# Altium project MixedSignalPCB.PrjPcb
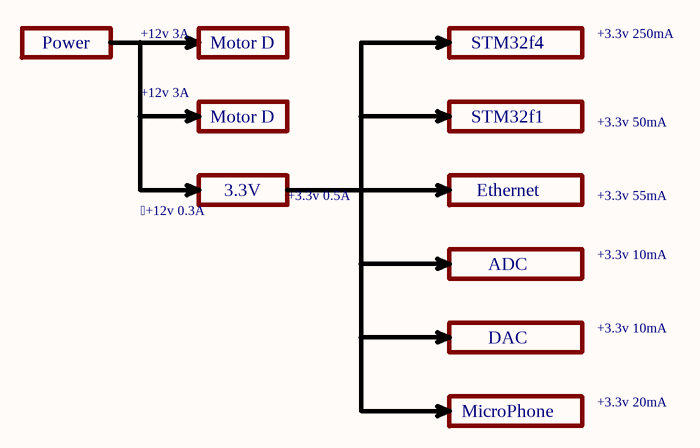
[diagram p0: Power.SchDoc]
11 sheets, 191 parts. Net scope: flat (ports and power ports of the same name join across sheets).
Board file: PCB1.PcbDoc
Sheets:
  Power.SchDoc
  Ethernet.SchDoc
  STM32F103_DEBUG.SchDoc
  STM32F407.SchDoc
  MotorDriver.SchDoc
  UART.SchDoc
  ADC.SchDoc
  DAC.SchDoc
  Mic.SchDoc
  MotorDriver2.SchDoc
  PowerSupply.SchDoc

## Sheet Power.SchDoc
size A4; SheetNumber: 1; SheetTotal: 8

### Notes on the sheet
- Power
- +12v 3A
- Motor D
- STM32f4
- +3.3v 250mA
- STM32f1
- +3.3v 50mA
- 3.3V
- +3.3v 0.5A
- Ethernet
- +3.3v 55mA
- +12v 0.3A
- ADC
- +3.3v 10mA
- DAC
- MicroPhone
- +3.3v 20mA

## Sheet Ethernet.SchDoc
size A; SheetNumber: 2; SheetTotal: 11
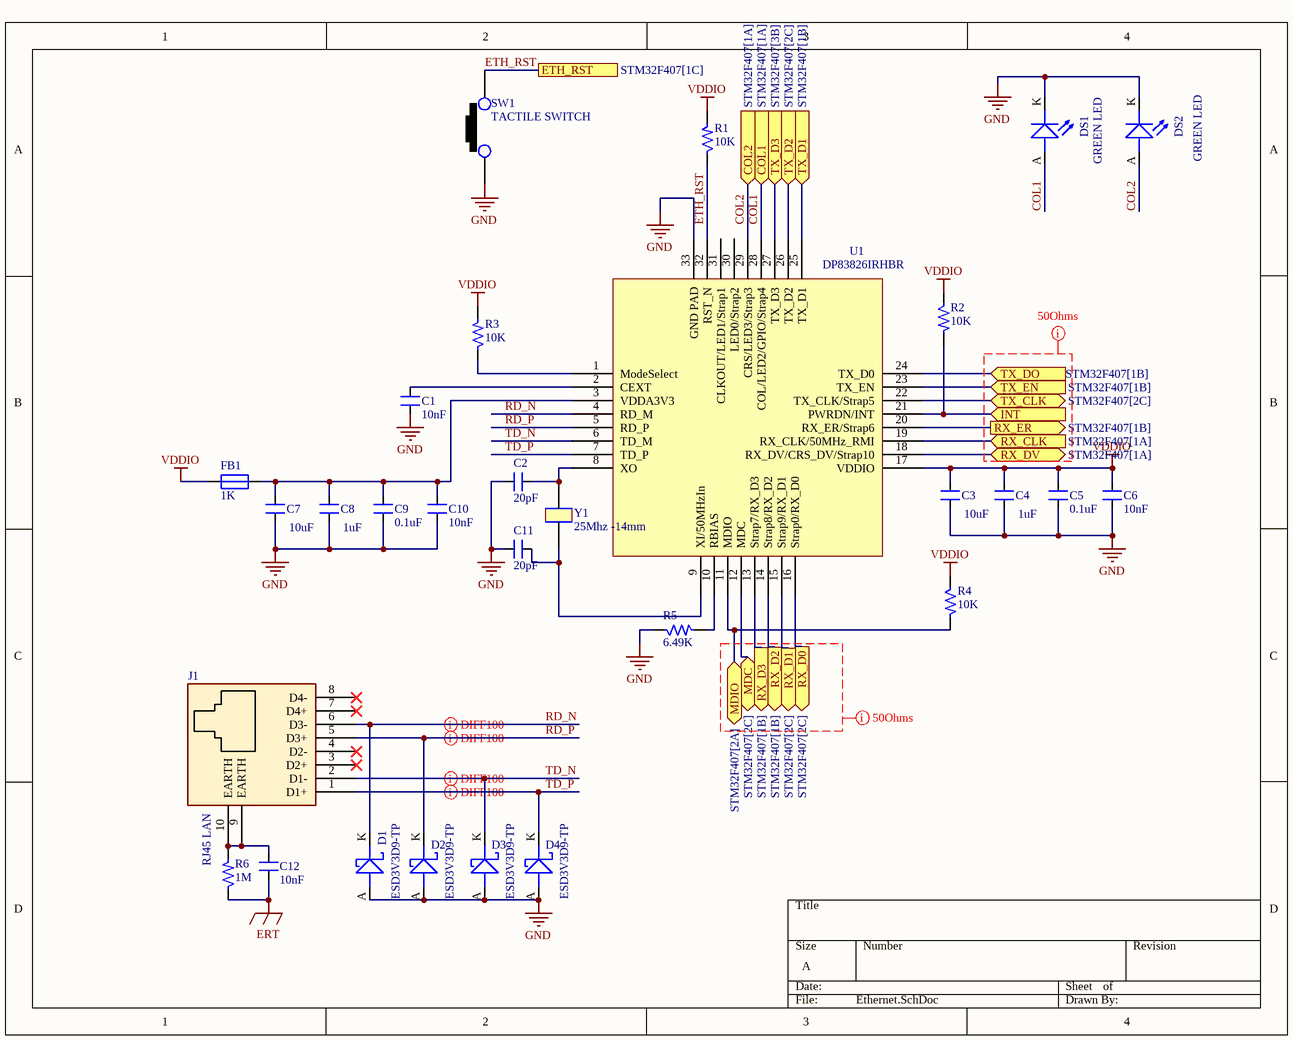
[diagram p1: Ethernet.SchDoc]

### Parts
C1  10nF  [CAP_0805]
C2  20pF  [CAP_0805]
C3  10uF  [CAP_1206]
C4  1uF  [CAP_0805]
C5  0.1uF  [CAP_0805]
C6  10nF  [CAP_0805]
C7  10uF  [CAP_1206]
C8  1uF  [CAP_0805]
C9  0.1uF  [CAP_0805]
C10  10nF  [CAP_0805]
C11  20pF  [CAP_0805]
C12  10nF  [CAP_P196_102X287_H332_RAD_TH]
D1  ESD3V3D9-TP  [DIO_SOD-923]
D2  ESD3V3D9-TP  [DIO_SOD-923]
D3  ESD3V3D9-TP  [DIO_SOD-923]
D4  ESD3V3D9-TP  [DIO_SOD-923]
DS1  GREEN LED  [LED_0805]
DS2  GREEN LED  [LED_0805]
FB1  1K  [IND_0805]
J1  RJ45 LAN  [CON10_P106_RJ45_TH_ST]
R1  10K  [RES_0805]
R2  10K  [RES_0603]
R3  10K  [RES_0805]
R4  10K  [RES_0603]
R5  6.49K  [RES_0805]
R6  1M  [RES_1206]
SW1  TACTILE SWITCH  [SW_342_SMD]
U1  DP83826IRHBR  [VQFN32_19_218_23X9_SMD]
Y1  25Mhz -14mm  [XTAL_314_240X47_SMD]

### Ports
COL1 (in, see STM32F407[1A]), COL2 (in, see STM32F407[1A]), ETH_RST (see STM32F407[1C]), INT (in), MDC (bidir, see STM32F407[2C]), MDIO (bidir, see STM32F407[2A]), RX_CLK (in, see STM32F407[1A]), RX_D0 (out, see STM32F407[2C]), RX_D1 (out, see STM32F407[2C]), RX_D2 (out, see STM32F407[1B]), RX_D3 (out, see STM32F407[1B]), RX_DV (bidir, see STM32F407[1A]), RX_ER (out, see STM32F407[1B]), TX_CLK (bidir, see STM32F407[2C]), TX_D1 (in, see STM32F407[1B]), TX_D2 (in, see STM32F407[2C]), TX_D3 (in, see STM32F407[3B]), TX_DO (in, see STM32F407[1B]), TX_EN (in, see STM32F407[1B])

### Nets
ERT: C12.1 R6.1
GND: C1.1 C2.1 C3.1 C4.1 C5.1 C6.1 C7.1 C8.1 C9.1 C10.1 C11.1 D1.A D2.A D3.A D4.A DS1.K(CATHODE) DS2.K(CATHODE) R5.1 SW1.1 U1.33(GND_PAD)
VDDIO: C3.2 C4.2 C5.2 C6.2 FB1.1 R1.2 R2.1 R3.2 R4.1 U1.17(VDDIO)
COL1: DS1.A(ANODE) U1.28(COL/LED2/GPIO/Strap4) ; port COL1
COL2: DS2.A(ANODE) U1.29(CRS/LED3/Strap3) ; port COL2
ETH_RST: R1.1 SW1.2 U1.32(RST_N) ; port ETH_RST
INT: R2.2 U1.21(PWRDN/INT) ; port INT
MDC: U1.12(MDC) ; port MDC
MDIO: R4.2 U1.11(MDIO) ; port MDIO
RD_N: D1.K J1.6(D3-) U1.4(RD_M)
RD_P: D2.K J1.5(D3+) U1.5(RD_P)
RX_CLK: U1.19(RX_CLK/50MHz_RMI) ; port RX_CLK
RX_D0: U1.16(Strap0/RX_D0) ; port RX_D0
RX_D1: U1.15(Strap9/RX_D1) ; port RX_D1
RX_D2: U1.14(Strap8/RX_D2) ; port RX_D2
RX_D3: U1.13(Strap7/RX_D3) ; port RX_D3
RX_DV: U1.18(RX_DV/CRS_DV/Strap10) ; port RX_DV
RX_ER: U1.20(RX_ER/Strap6) ; port RX_ER
TD_N: D3.K J1.2(D1-) U1.6(TD_M)
TD_P: D4.K J1.1(D1+) U1.7(TD_P)
TX_CLK: U1.22(TX_CLK/Strap5) ; port TX_CLK
TX_D1: U1.25(TX_D1) ; port TX_D1
TX_D2: U1.26(TX_D2) ; port TX_D2
TX_D3: U1.27(TX_D3) ; port TX_D3
TX_DO: U1.24(TX_D0) ; port TX_DO
TX_EN: U1.23(TX_EN) ; port TX_EN
NetC1_2: C1.2 U1.2(CEXT)
NetC2_2: C2.2 U1.8(XO) Y1.1
NetC7_2: C7.2 C8.2 C9.2 C10.2 FB1.2 U1.3(VDDA3V3)
NetC11_2: C11.2 U1.9(XI/50MHzIn) Y1.2
NetC12_2: C12.2 J1.9(EARTH) J1.10(EARTH) R6.2
NetR3_1: R3.1 U1.1(ModeSelect)
NetR5_2: R5.2 U1.10(RBIAS)

Not connected (* = marked no-connect by the designer): J1 3(D2+)* 4(D2-)* 7(D4+)* 8(D4-)*; U1 30(LED0/Strap2) 31(CLKOUT/LED1/Strap1)

### Layout directives
differential pair; differential pair class *DIFF100: RD_N, RD_P, TD_N, TD_P
net class *50Ohms: (no net found under the mark)

### Library data of the parts
C1 C6 C10 = CAP_10nF-50V-10%-0805: 10000pF ±10% 50V Ceramic Capacitor X7R 0805 (2012 Metric); Manufacturer: Samsung; Manufacturer Part Number: C0805C103K5RECAUTO; Alternate Part Number-1: GRM2195C1H103JA01D; Case/Package: 0805; Supplier-1: SIRICOM; Supplier Part Number-1: 0805B103K500CT
C2 C11 = CAP_20pF-50V-10%-0805: ±10% 50V Ceramic Capacitor C0G, NP0 0805 (2012 Metric); Manufacturer: AVX Corporation; Manufacturer Part Number: 08055A200KAT2A; Alternate Part Number-1: NA; Case/Package: 0805; Supplier-1: Digikey; Supplier Part Number-1: 478-11887-1-ND - Cut Tape (CT)
C3 C7 = CAP_10uF-50V-10%-1206: 10µF ±10% 50V Ceramic Capacitor X7R 1206 (3216 Metric); Manufacturer: KEMET; Manufacturer Part Number: CL31B106KBHNNNE; Alternate Part Number-1: GRT31CR61H106ME01L; Case/Package: 1206; Supplier-1: SIRICOM; Supplier Part Number-1: CC1206KKX5R9BB106
C4 C8 = CAP_1uF-50V-5%-0805: 1µF ±5% 50V Ceramic Capacitor X7R 0805 (2012 Metric); Manufacturer: Samsung; Manufacturer Part Number: CC0805JKX7R9BB105; Alternate Part Number-1: 0805F105M500NT; Case/Package: 0805; Supplier-1: SIRICOM; Supplier Part Number-1: CL21B105KBFNNNE
C5 C9 = CAP_0.1uF-50V-5%-0805: 0.1µF ±5% 50V Ceramic Capacitor X7R 0805 (2012 Metric); Manufacturer: AVX Corporation; Manufacturer Part Number: 08055C104JAT4A; Alternate Part Number-1: 0805B104M500; Case/Package: 0805; Supplier-1: SIRICOM; Supplier Part Number-1: 0805B104J500CT
C12 = CAP_10nF-1KV-10%-RAD-TH: 10000pF ±10% 1000V (1kV) Ceramic Capacitor X7R Radial; Manufacturer: Yageo; Manufacturer Part Number: RDER73A103K2K1H03B; Alternate Part Number-1: NA; Case/Package: TH; Supplier-1: SP ROAD; Supplier Part Number-1: RDER73A103K2K1H03B
D1-D4 = DIO-T_3.3V-8.8V-10A-SOD923: TVS DIODE 3.3V 8.8V SOD923; Manufacturer: Micro Commercial Co; Alternate Part Number-1: NA; Manufacturer Part Number: ESD3V3D9-TP; Case/Package: SOD923; Supplier-1: Digikey; Supplier Part Number-1: ESD3V3D9-TPMSTR-ND
DS1 DS2 = LED_GREEN-2.2-20mA-0805: Green 569nm LED Indication - Discrete 2.1V 0805 (2012 Metric); Manufacturer: Vishay Lite-On; Manufacturer Part Number: LTST-C171GKT; Alternate Part Number-1: NA; Case/Package: 0805; Supplier-1: SP ROAD; Supplier Part Number-1: LTST-C171GKT
FB1 = FB_1K-100MHZ-1.6A-0805: 1 kOhms @ 100MHz 1 Power Line Ferrite Bead 0805 (2012 Metric) 1.6A; Manufacturer: Laird; Manufacturer Part Number: BLM21SP102SH1D; Alternate Part Number-1: NA; Case/Package: 0805; Supplier-1: SIRICOM; Supplier Part Number-1: ACMS201209A102
J1 = CON-SKT-RJ_8C8P-RA-TH: 8 Pins, 2 Row 2.54mm Pitch, right angle Connector, male; Manufacturer: Assmann; Manufacturer Part Number: A-2004-2-4-LPS-N-R; Alternate Part Number-1: NA; Case/Package: TH-CON; Supplier-1: SP ROAD; Supplier Part Number-1: A-2004-2-4-LPS-N-R
R1 R3 = RES_10K-0.125W-1%-0805: 10 kOhms ±1% 0.125W, 1/8W Chip Resistor 0805 (2012 Metric) Automotive AEC-Q200 Thick Film; Manufacturer: CTS; Manufacturer Part Number: WR08X1002FTL; Case/Package: 0805; Supplier-1: SIRICOM; Supplier Part Number-1: WR08X1002FTL; Alternate Part Number-1: WR08X1002FTL
R2 R4 = RES_10K-0.1W-1%-0603: 10 kOhms ±1% 0.1W, 1/10W Chip Resistor 0603 (1608 Metric) Automotive AEC-Q200 Thick Film; Manufacturer: Walsin; Manufacturer Part Number: WR06X1002FTL; Alternate Part Number-1: 0603WAJ0103T5E; Case/Package: 0603; Supplier-1: SIRICOM; Supplier Part Number-1: WR06X1002FTL
R5 = RES_6.49K-0.125W-1%-0805: 6.49 kOhms ±1% 0.125W, 1/8W Chip Resistor 0805 (2012 Metric) Moisture Resistant Thick Film; Manufacturer: Stackpole Electronics; Manufacturer Part Number: RC0805FR-076K49L; Alternate Part Number-1: NA; Case/Package: 0805; Supplier-1: SIRICOM; Supplier Part Number-1: WRO8X6491FTL
R6 = RES_1M-0.25W-1%-1206: 1 MOhms ±1% 0.25W, 1/4W Chip Resistor 1206 (3216 Metric) Automotive AEC-Q200, High Voltage Thick Film; Manufacturer: Walsin; Manufacturer Part Number: WR12X1004FTL; Alternate Part Number-1: NA; Case/Package: 1206; Supplier-1: SIRICOM; Supplier Part Number-1: WR12X1004FTL
SW1 = SW1_RS-282G05A3-SMRT-SMD: Tactile Switch SPST-NO Top Actuated Surface Mount; Manufacturer: ITT C&K; Alternate Part Number-1: NA; Manufacturer Part Number: RS-282G05A3-SMRT; Case/Package: SMD; Supplier-1: SP ROAD; Supplier Part Number-1: RS-282G05A3-SMRT
U1 = IC_DP83826IRHBR: Ethernet ICs Low latency 10/100-Mbps PHY, MII interface and enhanced mode with an industrial temperature range 32-VQFN -40 to 85; Manufacturer: Texas Instruments; Alternate Part Number-1: NA; Manufacturer Part Number: DP83826IRHBR; Case/Package: 32-VQFN; Supplier-1: Mouser; Supplier Part Number-1: 595-DP83826IRHBR
Y1 = XTAL_25Mhz-FOXSDLF/250F-20: 25MHz ±30ppm Crystal 20pF 30 Ohms HC-49/US; Manufacturer: Abracon; Alternate Part Number-1: NA; Manufacturer Part Number: FOXSDLF/250F-20; Case/Package: SMD; Supplier-1: MOUSER; Supplier Part Number-1: FOXSDLF/250F-20

## Sheet STM32F103_DEBUG.SchDoc
size A; SheetNumber: 3; SheetTotal: 11
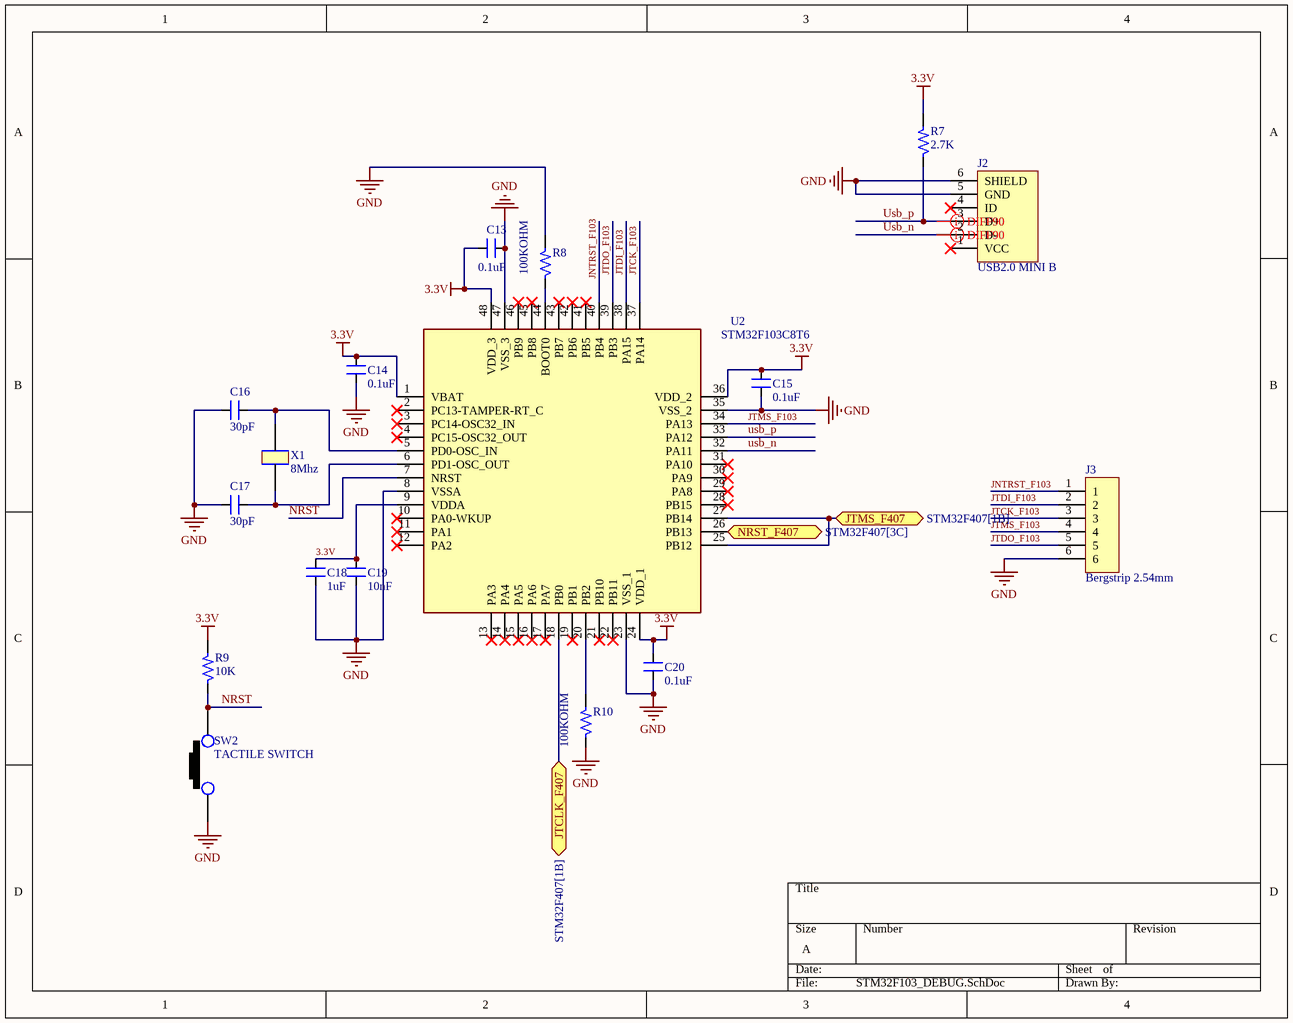
[diagram p2: STM32F103_DEBUG.SchDoc]

### Parts
C13  0.1uF  [CAP_0805]
C14  0.1uF  [CAP_0805]
C15  0.1uF  [CAP_0805]
C16  30pF  [CAP_0805]
C17  30pF  [CAP_0805]
C18  1uF  [CAP_0805]
C19  10nF  [CAP_0805]
C20  0.1uF  [CAP_0805]
J2  USB2.0 MINI B  [CON_690-005-299-043]
J3  Bergstrip 2.54mm  [CON6_100_59D78_TH_ST]
R7  2.7K  [RES_0805]
R8  100KOHM  [RES_2512]
R9  10K  [RES_0603]
R10  100KOHM  [RES_2512]
SW2  TACTILE SWITCH  [SW_342_SMD]
U2  STM32F103C8T6  [LQFP-48_19.6_393_58X11_SMD]
X1  8Mhz  [XTAL_314_240X47_SMD]

### Ports
JTCLK_F407 (bidir, see STM32F407[1B]), JTMS_F407 (bidir, see STM32F407[1B]), NRST_F407 (bidir, see STM32F407[3C])

### Nets
3.3V: C13.2 C14.2 C15.2 C18.2 C19.2 C20.2 R7.2 R9.2 U2.1(VBAT) U2.9(VDDA) U2.24(VDD_1) U2.36(VDD_2) U2.48(VDD_3)
GND: C13.1 C14.1 C15.1 C16.1 C17.1 C18.1 C19.1 C20.1 J2.5(GND) J2.6(SHIELD) J3.6 R8.2 R10.1 SW2.1 U2.8(VSSA) U2.23(VSS_1) U2.35(VSS_2) U2.47(VSS_3)
JNTRST_F103: J3.1 U2.40(PB4)
JTCK_F103: J3.3 U2.37(PA14)
JTCLK_F407: U2.18(PB0) ; port JTCLK_F407
JTDI_F103: J3.2 U2.38(PA15)
JTDO_F103: J3.5 U2.39(PB3)
JTMS_F103: J3.4 U2.34(PA13)
JTMS_F407: U2.25(PB12) U2.27(PB14) ; port JTMS_F407
NRST: R9.1 SW2.2 U2.7(NRST)
NRST_F407: U2.26(PB13) ; port NRST_F407
Usb_n: J2.2(D-) U2.32(PA11)
Usb_p: J2.3(D+) R7.1 U2.33(PA12)
NetC16_2: C16.2 U2.5(PD0-OSC_IN) X1.2
NetC17_2: C17.2 U2.6(PD1-OSC_OUT) X1.1
NetR8_1: R8.1 U2.44(BOOT0)
NetR10_2: R10.2 U2.20(PB2)

Not connected (* = marked no-connect by the designer): J2 1(VCC)* 4(ID)*; U2 2(PC13-TAMPER-RT_C)* 3(PC14-OSC32_IN)* 4(PC15-OSC32_OUT)* 10(PA0-WKUP)* 11(PA1)* 12(PA2)* 13(PA3)* 14(PA4)* 15(PA5)* 16(PA6)* 17(PA7)* 19(PB1)* 21(PB10)* 22(PB11)* 28(PB15)* 29(PA8)* 30(PA9)* 31(PA10)* 41(PB5)* 42(PB6)* 43(PB7)* 45(PB8)* 46(PB9)*

### Layout directives
differential pair; differential pair class *DIFF90: Usb_n, Usb_p

### Library data of the parts
C13-C15 = CAP_0.1uF-50V-20%-0805: 0.1µF ±20% 50V Ceramic Capacitor X7R 0805 (2012 Metric); Manufacturer: Samsung Electro-Mechanics; Manufacturer Part Number: CL21B104MBCNNNC; Alternate Part Number-1: NA; Case/Package: 0805; Supplier-1: SIRICOM; Supplier Part Number-1: 0805B104K500CT
C16 C17 = CAP_30pF-50V-10%-0805: ±10% 50V Ceramic Capacitor C0G, NP0 0805 (2012 Metric); Manufacturer Part Number: C0805C300K5GAC7800; Manufacturer: KEMET; Alternate Part Number: NA; Case/Package: 0805; Supplier-1: Digikey; Supplier Part Number-1: 399-17443-1-ND - Cut Tape (CT)
C18 = CAP_1uF-50V-5%-0805: as C4 on sheet Ethernet; Case/Package: 0805; Supplier-1: SIRICOM; Supplier Part Number-1: CL21B105KBFNNNE
C19 = CAP_10nF-50V-10%-0805: as C1 on sheet Ethernet; Case/Package: 0805; Supplier-1: SIRICOM; Supplier Part Number-1: 0805B103K500CT
C20 = CAP_0.1uF-50V-5%-0805: as C5 on sheet Ethernet; Case/Package: 0805; Supplier-1: SIRICOM; Supplier Part Number-1: 0805B104J500CT
J2 = CON_USB2.0-MINIB-SMD: USB - mini B USB 2.0 Receptacle Connector 5 Position Surface Mount, Right Angle; Manufacturer: EDAC; Manufacturer Part Number: 690-005-299-043; Alternate Part Number-1: NA; Case/Package: USB-MINI-B; Supplier-1: LCSC; Supplier Part Number-1: C105424
J3 = CON-BS-SKT_6X1-100-ST-TH: 6 Pins, 1 Row 2.54mm Pitch, Straight bergstrip, Female; Manufacturer: Molex; Alternate Part Number-1: NA; Manufacturer Part Number: 22-10-2061; Case/Package: TH-CON; Supplier-1: SP ROAD; Supplier Part Number-1: NA
R7 = RES_2.7K-0.125W-1%-0805: 2.7 kOhms ±1% 0.125W, 1/8W Chip Resistor 0805 (2012 Metric) Thick Film; Manufacturer: Stackpole Electronics; Manufacturer Part Number: 1623181-1; Alternate Part Number-1: NA; Case/Package: 0805; Supplier-1: SIRICOM; Supplier Part Number-1: WR08X2701FTL
R8 R10 = RES_100mOHM-1W-5%-2512: 100 mOhms ±5% 1W Chip Resistor 2512 (6432 Metric) High Voltage, Non-Magnetic Thick Film; Manufacturer: CTS Resistor Products; Manufacturer Part Number: 73L7R10J; Alternate Part Number-1: CR2512J0R12E04; Case/Package: 2512; Supplier-1: SP ROAD; Supplier Part Number-1: NA
R9 = RES_10K-0.1W-1%-0603: as R2 on sheet Ethernet; Case/Package: 0603; Supplier-1: SIRICOM; Supplier Part Number-1: WR06X1002FTL
SW2 = SW1_RS-282G05A3-SMRT-SMD: as SW1 on sheet Ethernet; Manufacturer Part Number: RS-282G05A3-SMRT; Case/Package: SMD; Supplier-1: SP ROAD; Supplier Part Number-1: RS-282G05A3-SMRT
U2 = IC_STM32F103C8T6: ARM® Cortex®-M3 STM32F1 Microcontroller IC 32-Bit 72MHz 64KB (64K x 8) FLASH 48-LQFP (7x7); Manufacturer: STMicroelectronics; Alternate Part Number-1: NA; Manufacturer Part Number: STM32F103C8T6; Case/Package: LQFP48; Supplier-1: LCSC; Supplier Part Number-1: STM32F103C8T6
X1 = XTAL_8MHZ-ECS-80-32-5PX-SMD: 8MHz ±30ppm Crystal 32pF 60 Ohms HC-49/US; Manufacturer: Fox Electronics; Manufacturer Part Number: ECS-80-32-5PX-TR; Alternate Part Number-1: NA; Case/Package: SMD/SMT; Supplier-1: SP ROAD; Supplier Part Number-1: ECS-80-32-5PX-TR

## Sheet STM32F407.SchDoc
size A; SheetNumber: 4; SheetTotal: 11
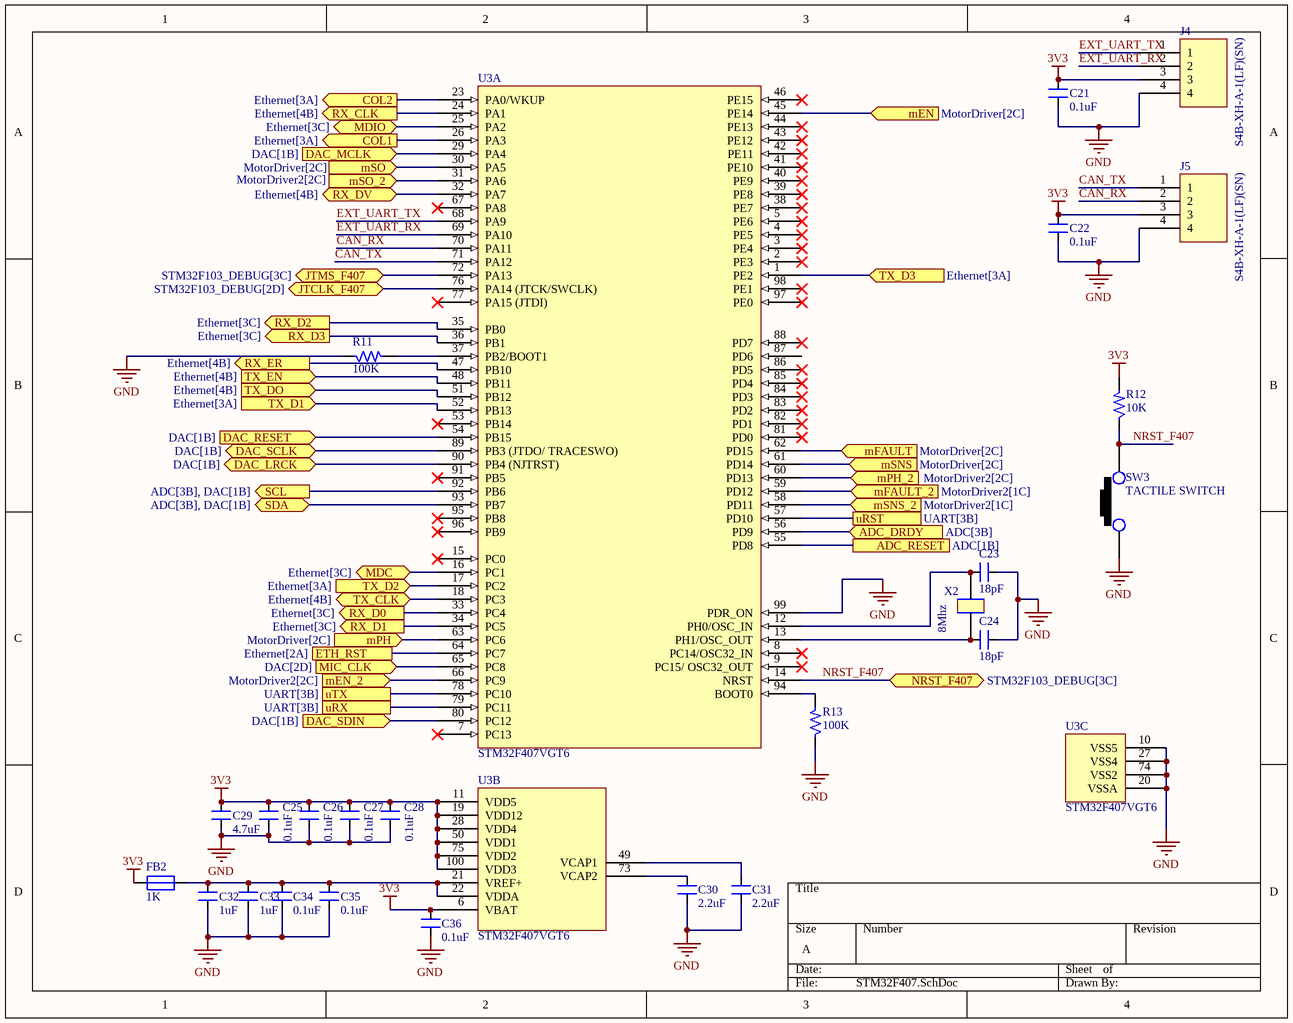
[diagram p3: STM32F407.SchDoc]

### Parts
C21  0.1uF  [CAP_0805]
C22  0.1uF  [CAP_0805]
C23  18pF  [CAP_0805]
C24  18pF  [CAP_0805]
C25  0.1uF  [CAP_0805]
C26  0.1uF  [CAP_0805]
C27  0.1uF  [CAP_0805]
C28  0.1uF  [CAP_0805]
C29  4.7uF  [CAP_0805]
C30  2.2uF  [CAP_0805]
C31  2.2uF  [CAP_0805]
C32  1uF  [CAP_0805]
C33  1uF  [CAP_0805]
C34  0.1uF  [CAP_0805]
C35  0.1uF  [CAP_0805]
C36  0.1uF  [CAP_0805]
FB2  1K  [IND_0805]
J4  S4B-XH-A-1(LF)(SN)  [CON4_100_S4B-XH-A_TH_RA]
J5  S4B-XH-A-1(LF)(SN)  [CON4_100_S4B-XH-A_TH_RA]
R11  100K  [RES_0805]
R12  10K  [RES_0603]
R13  100K  [RES_0805]
SW3  TACTILE SWITCH  [SW_342_SMD]
U3  STM32F407VGT6  [QFN100_19.6_669_58X10_SMD]  (parts A,B,C of 3)
X2  8Mhz  [XTAL_314_240X47_SMD]

### Ports
ADC_DRDY (in, see ADC[3B]), ADC_RESET (see ADC[1B]), COL1 (out, see Ethernet[3A]), COL2 (out, see Ethernet[3A]), DAC_LRCK (bidir, see DAC[1B]), DAC_MCLK (in, see DAC[1B]), DAC_RESET (in, see DAC[1B]), DAC_SCLK (bidir, see DAC[1B]), DAC_SDIN (in, see DAC[1B]), ETH_RST (see Ethernet[2A]), JTCLK_F407 (bidir, see STM32F103_DEBUG[2D]), JTMS_F407 (bidir, see STM32F103_DEBUG[3C]), MDC (bidir, see Ethernet[3C]), MDIO (bidir, see Ethernet[3C]), mEN (in, see MotorDriver[2C]), mEN_2 (in, see MotorDriver2[2C]), mFAULT (in, see MotorDriver[2C]), mFAULT_2 (in, see MotorDriver2[1C]), MIC_CLK (in, see DAC[2D]), mPH (in, see MotorDriver[2C]), mPH_2 (in, see MotorDriver2[2C]), mSNS (in, see MotorDriver[2C]), mSNS_2 (in, see MotorDriver2[1C]), mSO (in, see MotorDriver[2C]), mSO_2 (in, see MotorDriver2[2C]), NRST_F407 (bidir, see STM32F103_DEBUG[3C]), RX_CLK (out, see Ethernet[4B]), RX_D0 (out, see Ethernet[3C]), RX_D1 (out, see Ethernet[3C]), RX_D2 (out, see Ethernet[3C]), RX_D3 (out, see Ethernet[3C]), RX_DV (bidir, see Ethernet[4B]), RX_ER (out, see Ethernet[4B]), SCL (out, see ADC[3B], DAC[1B]), SDA (bidir, see ADC[3B], DAC[1B]), TX_CLK (bidir, see Ethernet[4B]), TX_D1 (in, see Ethernet[3A]), TX_D2 (in, see Ethernet[3A]), TX_D3 (in, see Ethernet[3A]), TX_DO (in, see Ethernet[4B]), TX_EN (in, see Ethernet[4B]), uRST (see UART[3B]), uRX (see UART[3B]), uTX (see UART[3B])

### Nets
3V3: C21.2 C22.2 C25.2 C26.2 C27.2 C28.2 C29.1 C36.2 FB2.1 J4.3 J5.3 R12.2 U3.6(VBAT) U3.11(VDD5) U3.19(VDD12) U3.28(VDD4) U3.50(VDD1) U3.75(VDD2) U3.100(VDD3)
GND: C21.1 C22.1 C23.2 C24.2 C25.1 C26.1 C27.1 C28.1 C29.2 C30.2 C31.1 C32.1 C33.1 C34.1 C35.1 C36.1 J4.4 J5.4 R11.1 R13.1 SW3.1 U3.10(VSS5) U3.20(VSSA) U3.27(VSS4) U3.74(VSS2) U3.99(PDR_ON)
ADC_DRDY: U3.56(PD9) ; port ADC_DRDY
ADC_RESET: U3.55(PD8) ; port ADC_RESET
CAN_RX: J5.2 U3.70(PA11)
CAN_TX: J5.1 U3.71(PA12)
COL1: U3.26(PA3) ; port COL1
COL2: U3.23(PA0/WKUP) ; port COL2
DAC_LRCK: U3.90(PB4_(NJTRST)) ; port DAC_LRCK
DAC_MCLK: U3.29(PA4) ; port DAC_MCLK
DAC_RESET: U3.54(PB15) ; port DAC_RESET
DAC_SCLK: U3.89(PB3_(JTDO/_TRACESWO)) ; port DAC_SCLK
DAC_SDIN: U3.80(PC12) ; port DAC_SDIN
ETH_RST: U3.64(PC7) ; port ETH_RST
EXT_UART_RX: J4.2 U3.69(PA10)
EXT_UART_TX: J4.1 U3.68(PA9)
JTCLK_F407: U3.76(PA14_(JTCK/SWCLK)) ; port JTCLK_F407
JTMS_F407: U3.72(PA13) ; port JTMS_F407
MDC: U3.16(PC1) ; port MDC
MDIO: U3.25(PA2) ; port MDIO
mEN: U3.45(PE14) ; port mEN
mEN_2: U3.66(PC9) ; port mEN_2
mFAULT: U3.62(PD15) ; port mFAULT
mFAULT_2: U3.59(PD12) ; port mFAULT_2
MIC_CLK: U3.65(PC8) ; port MIC_CLK
mPH: U3.63(PC6) ; port mPH
mPH_2: U3.60(PD13) ; port mPH_2
mSNS: U3.61(PD14) ; port mSNS
mSNS_2: U3.58(PD11) ; port mSNS_2
mSO: U3.30(PA5) ; port mSO
mSO_2: U3.31(PA6) ; port mSO_2
NRST_F407: R12.1 SW3.2 U3.14(NRST) ; port NRST_F407
RX_CLK: U3.24(PA1) ; port RX_CLK
RX_D0: U3.33(PC4) ; port RX_D0
RX_D1: U3.34(PC5) ; port RX_D1
RX_D2: U3.35(PB0) ; port RX_D2
RX_D3: U3.36(PB1) ; port RX_D3
RX_DV: U3.32(PA7) ; port RX_DV
RX_ER: U3.47(PB10) ; port RX_ER
SCL: U3.92(PB6) ; port SCL
SDA: U3.93(PB7) ; port SDA
TX_CLK: U3.18(PC3) ; port TX_CLK
TX_D1: U3.52(PB13) ; port TX_D1
TX_D2: U3.17(PC2) ; port TX_D2
TX_D3: U3.1(PE2) ; port TX_D3
TX_DO: U3.51(PB12) ; port TX_DO
TX_EN: U3.48(PB11) ; port TX_EN
uRST: U3.57(PD10) ; port uRST
uRX: U3.79(PC11) ; port uRX
uTX: U3.78(PC10) ; port uTX
NetC23_1: C23.1 U3.12(PH0/OSC_IN) X2.2
NetC24_1: C24.1 U3.13(PH1/OSC_OUT) X2.1
NetC30_1: C30.1 U3.73(VCAP2)
NetC31_2: C31.2 U3.49(VCAP1)
NetC32_2: C32.2 C33.2 C34.2 C35.2 FB2.2 U3.21(VREF+) U3.22(VDDA)
NetR11_2: R11.2 U3.37(PB2/BOOT1)
NetR13_2: R13.2 U3.94(BOOT0)

Not connected (* = marked no-connect by the designer): U3 2(PE3)* 3(PE4)* 4(PE5)* 5(PE6)* 7(PC13)* 8(PC14/OSC32_IN)* 9(PC15/_OSC32_OUT)* 15(PC0)* 38(PE7)* 39(PE8)* 40(PE9)* 41(PE10)* 42(PE11)* 43(PE12)* 44(PE13)* 46(PE15)* 53(PB14)* 67(PA8)* 77(PA15_(JTDI))* 81(PD0)* 82(PD1)* 83(PD2)* 84(PD3)* 85(PD4)* 86(PD5)* 87(PD6) 88(PD7)* 91(PB5)* 95(PB8)* 96(PB9)* 97(PE0)* 98(PE1)*

### Library data of the parts
C21 C22 C25-C28 C34-C36 = CAP_0.1uF-50V-5%-0805: as C5 on sheet Ethernet; Case/Package: 0805; Supplier-1: SIRICOM; Supplier Part Number-1: 0805B104J500CT
C23 C24 = CAP_18pF-50V-5%-0805: 18pF ±5% 50V Ceramic Capacitor C0G, NP0 0805 (2012 Metric); Manufacturer: Yageo; Manufacturer Part Number: CL21C180JBANNNC; Alternate Part Number-1: NA; Case/Package: 0805; Supplier-1: NA; Supplier Part Number-1: NA
C29 = CAP_4.7uF-50V-10%-0805: 4.7µF ±10% 50V Ceramic Capacitor X5R 0805 (2012 Metric); Manufacturer: Yageo; Manufacturer Part Number: GRM21BR61H475KE51L; Alternate Part Number-1: NA; Case/Package: 0805; Supplier-1: SIRICOM; Supplier Part Number-1: CL21A475KBQNNNE
C30 C31 = CAP_2.2uF-25V-10%-0805: 2.2µF ±10% 25V Ceramic Capacitor X7R 0805 (2012 Metric); Manufacturer: KEMET; Manufacturer Part Number: CL21B225KAFNFNE; Alternate Part Number-1: NA; Case/Package: 0805; Supplier-1: SIRICOM; Supplier Part Number-1: CL21A225KAFNNNE
C32 C33 = CAP_1uF-50V-5%-0805: as C4 on sheet Ethernet; Case/Package: 0805; Supplier-1: SIRICOM; Supplier Part Number-1: CL21B105KBFNNNE
FB2 = FB_1K-100MHZ-1.6A-0805: as FB1 on sheet Ethernet; Case/Package: 0805; Supplier-1: SIRICOM; Supplier Part Number-1: ACMS201209A102
J4 J5 = CON-PLG_4X1-100-RA-TH: 4 Pins, 1 Row 2.54mm Pitch, right angle Connector, male; Manufacturer: Wurth Electronics; Mating Part Number: XHP-4; Crimp Part Number: ASXHSXH22K51; Alternate Part Number-1: NA; Manufacturer Part Number: S4B-XH-A-1(LF)(SN); Case/Package: TH-CON; Supplier-1: LCSC; Supplier Part Number-1: S4B-XH-A
R11 R13 = RES_100K-0.125W-1%-0805: 100 kOhms ±1% 0.125W, 1/8W Chip Resistor 0805 (2012 Metric) Automotive AEC-Q200 Thick Film; Manufacturer: Walsin; Manufacturer Part Number: WR08X1003FTL; Alternate Part Number-1: NA; Case/Package: 0805; Supplier-1: SIRICOM; Supplier Part Number-1: WR08X1003FTL
R12 = RES_10K-0.1W-1%-0603: as R2 on sheet Ethernet; Case/Package: 0603; Supplier-1: SIRICOM; Supplier Part Number-1: WR06X1002FTL
SW3 = SW1_RS-282G05A3-SMRT-SMD: as SW1 on sheet Ethernet; Manufacturer Part Number: RS-282G05A3-SMRT; Case/Package: SMD; Supplier-1: SP ROAD; Supplier Part Number-1: RS-282G05A3-SMRT
U3 = IC_STM32F407VGT6: ARM® Cortex®-M4 STM32F4 Microcontroller IC 32-Bit 168MHz 1MB (1M x 8) FLASH 100-LQFP (14x14); Manufacturer: STMicroelectronics; Alternate Part Number-1: STM32F407VET6; Manufacturer Part Number: STM32F407VGT6; Case/Package: LQFP100; Supplier-1: ARROW; Supplier Part Number-1: STM32F407VGT6
X2 = XTAL_8MHZ-ECS-80-32-5PX-SMD: as X1 on sheet STM32F103_DEBUG; Case/Package: SMD/SMT; Supplier-1: SP ROAD; Supplier Part Number-1: ECS-80-32-5PX-TR

## Sheet MotorDriver.SchDoc
size A4; SheetNumber: 5; SheetTotal: 11
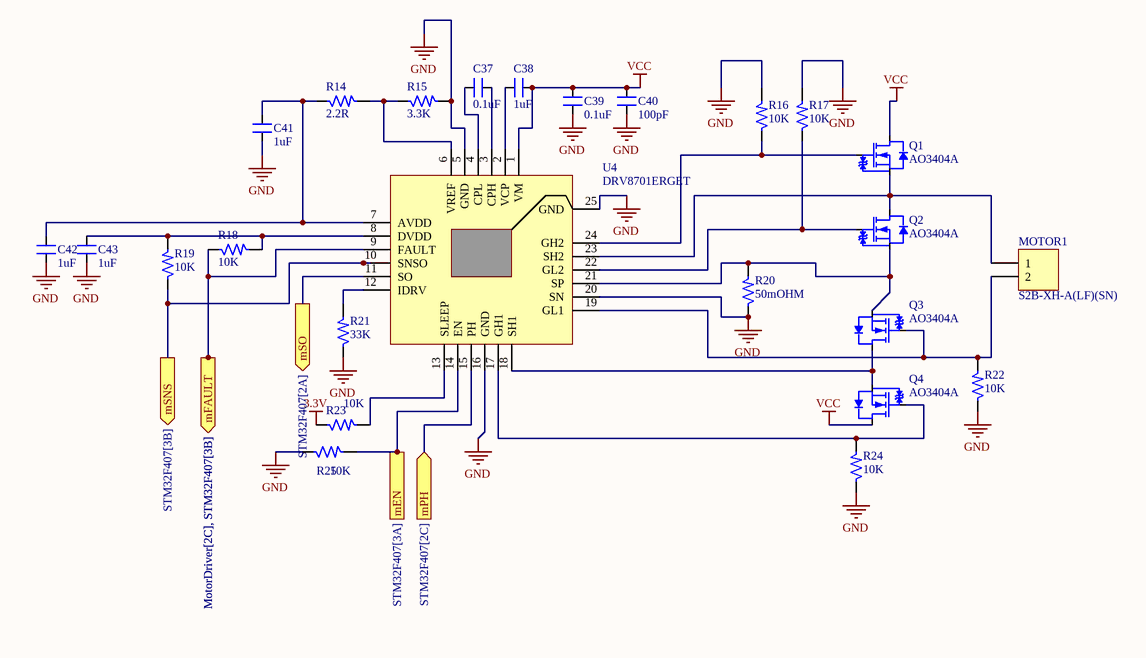
[diagram p4: MotorDriver.SchDoc]

### Parts
C37  0.1uF  [CAP_0805]
C38  1uF  [CAP_0805]
C39  0.1uF  [CAP_0805]
C40  100pF  [CAP_0805]
C41  1uF  [CAP_0805]
C42  1uF  [CAP_0805]
C43  1uF  [CAP_0805]
MOTOR1  S2B-XH-A(LF)(SN)  [CON2_100_S2B-XH-A_TH_RA]
Q1  AO3404A  [SOT 23-3]
Q2  AO3404A  [SOT 23-3]
Q3  AO3404A  [SOT 23-3]
Q4  AO3404A  [SOT 23-3]
R14  2.2R  [RES_0603]
R15  3.3K  [RES_0805]
R16  10K  [RES_0805]
R17  10K  [RES_0805]
R18  10K  [RES_0805]
R19  10K  [RES_0805]
R20  50mOHM  [RES_2512]
R21  33K  [RES_0805]
R22  10K  [RES_0805]
R23  10K  [RES_0805]
R24  10K  [RES_0805]
R25  10K  [RES_0805]
U4  DRV8701ERGET  [VFQFN24_19.6_196_12X32_SMD_1]

### Ports
mEN (in, see STM32F407[3A]), mFAULT (out, see MotorDriver[2C], STM32F407[3B]), mPH (in, see STM32F407[2C]), mSNS (out, see STM32F407[3B]), mSO (out, see STM32F407[2A])

### Nets
3.3V: R23.1
GND: C39.1 C40.1 C41.1 C42.1 C43.1 R15.2 R16.2 R17.2 R20.1 R21.1 R22.1 R24.1 R25.1 U4.5(GND) U4.16(GND) U4.20(SN) U4.25(GND)
VCC: C38.1 C39.2 C40.2 Q1.3(D) Q4.3(D) U4.1(VM)
mEN: R25.2 U4.14(EN) ; port mEN
mFAULT: R18.1 U4.9(FAULT) ; port mFAULT
mPH: U4.15(PH) ; port mPH
mSNS: R19.1 U4.10(SNSO) ; port mSNS
mSO: U4.11(SO) ; port mSO
NetC37_1: C37.1 U4.3(CPH)
NetC37_2: C37.2 U4.4(CPL)
NetC38_2: C38.2 U4.2(VCP)
NetC41_2: C41.2 C42.2 R14.1 U4.7(AVDD)
NetC43_2: C43.2 R18.2 R19.2 U4.8(DVDD)
NetMOTOR1_1: MOTOR1.1 Q1.2(S) Q2.3(D) U4.23(SH2)
NetMOTOR1_2: MOTOR1.2 Q3.1(G) R22.2 U4.19(GL1)
NetQ1_1: Q1.1(G) R16.1 U4.24(GH2)
NetQ2_1: Q2.1(G) R17.1 U4.22(GL2)
NetQ2_2: Q2.2(S) Q3.2(S) R20.2 U4.21(SP)
NetQ3_3: Q3.3(D) Q4.2(S) U4.18(SH1)
NetQ4_1: Q4.1(G) R24.2 U4.17(GH1)
NetR14_2: R14.2 R15.1 U4.6(VREF)
NetR21_2: R21.2 U4.12(IDRV)
NetR23_2: R23.2 U4.13(SLEEP)

### Library data of the parts
C37 C39 = CAP_0.1uF-50V-20%-0805: as C13 on sheet STM32F103_DEBUG; Case/Package: 0805; Supplier-1: SIRICOM; Supplier Part Number-1: 0805B104K500CT
C38 C41-C43 = CAP_1uF-50V-5%-0805: as C4 on sheet Ethernet; Case/Package: 0805; Supplier-1: SIRICOM; Supplier Part Number-1: CL21B105KBFNNNE
C40 = CAP_100pF-100V-5%-0805: 100pF ±5% 100V Ceramic Capacitor C0G, NP0 0805 (2012 Metric); Manufacturer: Murata; Manufacturer Part Number: CL21C101JC61PNC; Alternate Part Number-1: NA; Case/Package: 0805; Supplier-1: SIRICOM; Supplier Part Number-1: 0805N101J101CT
MOTOR1 = CON-PLG_2X1-100-RA-TH: 2 Pins, 1 Row 2.54mm Pitch, right angle Connector, male; Manufacturer: JST; Mating Part Number: XHP-2; Crimp Part Number: ASXHSXH22K51; Alternate Part Number-1: NA; Manufacturer Part Number: S2B-XH-A(LF)(SN); Case/Package: TH-CON; Supplier-1: ARROW; Supplier Part Number-1: S2B-XH-A(LF)(SN)
Q1-Q4 = MOSFET-N_30V-5.8A-SOT23: N-Channel 30V 5.8A (Ta) 1.4W (Ta) Surface Mount SOT-23-3L; Manufacturer: International Rectifier; Alternate Part Number-1: PMV50ENEAR; Manufacturer Part Number: AO3404A; Case/Package: SOT23; Supplier-1: ARROW; Supplier Part Number-1: AO3404A
R14 = RES_2.2R-0.1W-1%-0603: 2.2 Ohms ±1% 0.1W, 1/10W Chip Resistor 0603 (1608 Metric) Automotive AEC-Q200, Current Sense Thick Film; Manufacturer: Panasonic Electronic Components; Manufacturer Part Number: ERJ-3RQF2R2V; Alternate Part Number-1: NA; Case/Package: 0603; Supplier-1: SIRICOM; Supplier Part Number-1: NA
R15 = RES_3.3K-0.125W-1%-0805: 3.3 kOhms ±1% 0.125W, 1/8W Chip Resistor 0805 (2012 Metric) Thick Film; Manufacturer: Panasonic; Manufacturer Part Number: 1623214-1; Alternate Part Number-1: 0805W8F3301T5E; Case/Package: 0805; Supplier-1: SIRICOM; Supplier Part Number-1: WR08X3301FTL
R16-R19 R22-R25 = RES_10K-0.125W-1%-0805: as R1 on sheet Ethernet; Case/Package: 0805; Supplier-1: SIRICOM; Supplier Part Number-1: WR08X1002FTL; Alternate Part Number-1: WR08X1002FTL
R20 = RES_50mOhm-2W-1%-2512: 50 mOhms ±1% 2W Chip Resistor 2512 (6432 Metric) Automotive AEC-Q200, Current Sense, Moisture Resistant Metal Element; Manufacturer: Yageo; Manufacturer Part Number: PA2512FKF7W0R05E; Alternate Part Number-1: PMR100HZPFU5L00; Case/Package: 2512; Supplier-1: SIRICOM; Supplier Part Number-1: LR2512-22R060F1
R21 = RES_33K-0.125W-1%-0805: Thick Film Resistors - SMD 33KOhms 1/8W 150V33 kOhms ±1% 0.125W, 1/8W Chip Resistor 0805 (2012 Metric) Thick Film; Manufacturer: Vishay BCcomponents; Manufacturer Part Number: CRG0805F33K; Alternate Part Number-1: NA; Case/Package: 0805; Supplier-1: SIRICOM; Supplier Part Number-1: WR08X3302FTL
U4 = IC_DRV8701ERGET: Motor Driver Power MOSFET Parallel 24-VQFN (4x4); Manufacturer: Texas Instruments; Alternate Part Number-1: NA; Manufacturer Part Number: DRV8701ERGET; Case/Package: VFQFN24; Supplier-1: ARROW; Supplier Part Number-1: DRV8701ERGET

## Sheet UART.SchDoc
size A4; SheetNumber: 6; SheetTotal: 11
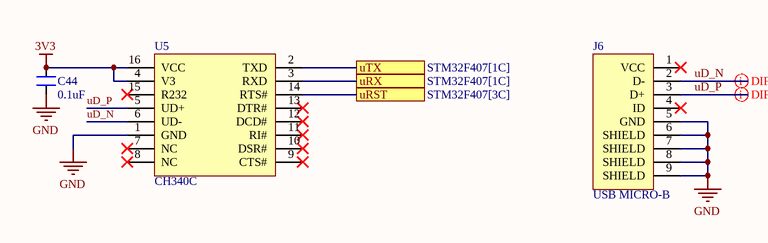
[diagram p5: UART.SchDoc]

### Parts
C44  0.1uF  [CAP_0805]
J6  USB MICRO-B  [CON_10118192-0001LF_SMD]
U5  CH340C  [SOIC16_50_284_25X90_SMT]

### Ports
uRST (see STM32F407[3C]), uRX (see STM32F407[1C]), uTX (see STM32F407[1C])

### Nets
3V3: C44.2 U5.4(V3) U5.16(VCC)
GND: C44.1 J6.5(GND) J6.6(SHIELD) J6.7(SHIELD) J6.8(SHIELD) J6.9(SHIELD) U5.1(GND)
uD_N: J6.2(D-) U5.6(UD-)
uD_P: J6.3(D+) U5.5(UD+)
uRST: U5.14(RTS#) ; port uRST
uRX: U5.3(RXD) ; port uRX
uTX: U5.2(TXD) ; port uTX

Not connected (* = marked no-connect by the designer): J6 1(VCC)* 4(ID)*; U5 7(NC)* 8(NC)* 9(CTS#)* 10(DSR#)* 11(RI#)* 12(DCD#)* 13(DTR#)* 15(R232)*

### Layout directives
differential pair; differential pair class *DIFF90: uD_N, uD_P

### Library data of the parts
C44 = CAP_0.1uF-50V-5%-0805: as C5 on sheet Ethernet; Case/Package: 0805; Supplier-1: SIRICOM; Supplier Part Number-1: 0805B104J500CT
J6 = CON_USB2.0_MICROB-SMD: USB - micro B USB 2.0 Receptacle Connector 5 Position Surface Mount, Right Angle; Manufacturer: ICC; Manufacturer Part Number: 10118192-0001LF; Alternate Part Number-1: NA; Case/Package: USB MICRO-B SMD; Supplier-1: SUNROM; Supplier Part Number-1: MICRO USB
U5 = IC_CH340C: USB Bridge, USB to UART USB 2.0 UART Interface; Manufacturer: Olimex; Alternate Part Number-1: NA; Manufacturer Part Number: CH340C; Case/Package: SOIC16; Supplier-1: LCSC; Supplier Part Number-1: C84681

## Sheet ADC.SchDoc
size A4; SheetNumber: 7; SheetTotal: 11
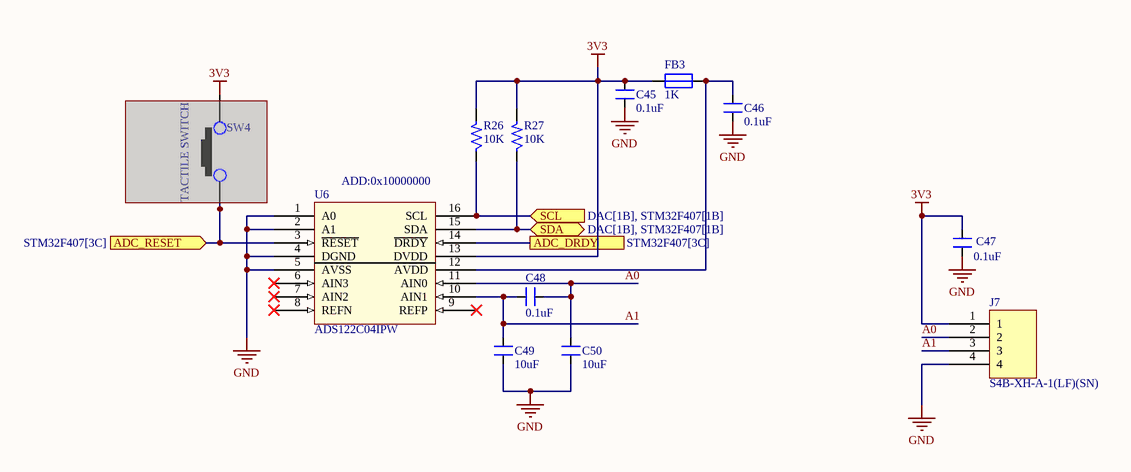
[diagram p6: ADC.SchDoc]

### Parts
C45  0.1uF  [CAP_0805]
C46  0.1uF  [CAP_0805]
C47  0.1uF  [CAP_0805]
C48  0.1uF  [CAP_0805]
C49  10uF  [CAP_1206]
C50  10uF  [CAP_1206]
FB3  1K  [IND_0805]
J7  S4B-XH-A-1(LF)(SN)  [CON4_100_S4B-XH-A_TH_RA]
R26  10K  [RES_0603]
R27  10K  [RES_0603]
SW4  TACTILE SWITCH  [SW_342_SMD]
U6  ADS122C04IPW  [TSSOP16_25-59_294_54X14_SMT]

### Ports
ADC_DRDY (see STM32F407[3C]), ADC_RESET (in, see STM32F407[3C]), SCL (in, see DAC[1B], STM32F407[1B]), SDA (bidir, see DAC[1B], STM32F407[1B])

### Nets
3V3: C45.2 C47.2 FB3.2 J7.1 R26.2 R27.2 SW4.2 U6.13(DVDD)
GND: C45.1 C46.1 C47.1 C49.1 C50.1 J7.4 U6.1(A0) U6.2(A1) U6.4(DGND) U6.5(AVSS)
A0: C48.1 C50.2 J7.2 U6.11(AIN0)
A1: C48.2 C49.2 J7.3 U6.10(AIN1)
ADC_DRDY: U6.14(~{DRDY}) ; port ADC_DRDY
ADC_RESET: SW4.1 U6.3(~{RESET}) ; port ADC_RESET
SCL: R26.1 U6.16(SCL) ; port SCL
SDA: R27.1 U6.15(SDA) ; port SDA
NetC46_2: C46.2 FB3.1 U6.12(AVDD)

Not connected (* = marked no-connect by the designer): U6 6(AIN3)* 7(AIN2)* 8(REFN)* 9(REFP)*

### Notes on the sheet
- (near U6) ADD:0x10000000

### Library data of the parts
C45-C47 = CAP_0.1uF-50V-10%-0805: 0.1µF ±10% 50V Ceramic Capacitor X7R 0805 (2012 Metric); Manufacturer: Samsung; Manufacturer Part Number: CL21B104KBCNNNC; Alternate Part Number-1: NA; Case/Package: 0805; Supplier-1: SIRICOM; Supplier Part Number-1: 0805B104K500CT
C48 = CAP_0.1uF-50V-5%-0805: as C5 on sheet Ethernet; Case/Package: 0805; Supplier-1: SIRICOM; Supplier Part Number-1: 0805B104J500CT
C49 C50 = CAP_10uF-50V-10%-1206: as C3 on sheet Ethernet; Case/Package: 1206; Supplier-1: SIRICOM; Supplier Part Number-1: CC1206KKX5R9BB106
FB3 = FB_1K-100MHZ-1.6A-0805: as FB1 on sheet Ethernet; Case/Package: 0805; Supplier-1: SIRICOM; Supplier Part Number-1: ACMS201209A102
J7 = CON-PLG_4X1-100-RA-TH: as J4 on sheet STM32F407; Manufacturer Part Number: S4B-XH-A-1(LF)(SN); Case/Package: TH-CON; Supplier-1: LCSC; Supplier Part Number-1: S4B-XH-A
R26 R27 = RES_10K-0.1W-1%-0603: as R2 on sheet Ethernet; Case/Package: 0603; Supplier-1: SIRICOM; Supplier Part Number-1: WR06X1002FTL
SW4 = SW1_RS-282G05A3-SMRT-SMD: as SW1 on sheet Ethernet; Manufacturer Part Number: RS-282G05A3-SMRT; Case/Package: SMD; Supplier-1: SP ROAD; Supplier Part Number-1: RS-282G05A3-SMRT
U6 = IC_ADS122C04IPW: 24 Bit Analog to Digital Converter 4 Input 1 Sigma-Delta 16-TSSOP; Manufacturer: Texas Instruments; Alternate Part Number-1: NA; Manufacturer Part Number: ADS122C04IPW; Case/Package: TSSOP16; Supplier-1: MOUSER; Supplier Part Number-1: ADS122C04IPW

## Sheet DAC.SchDoc
size A4; SheetNumber: 8; SheetTotal: 11
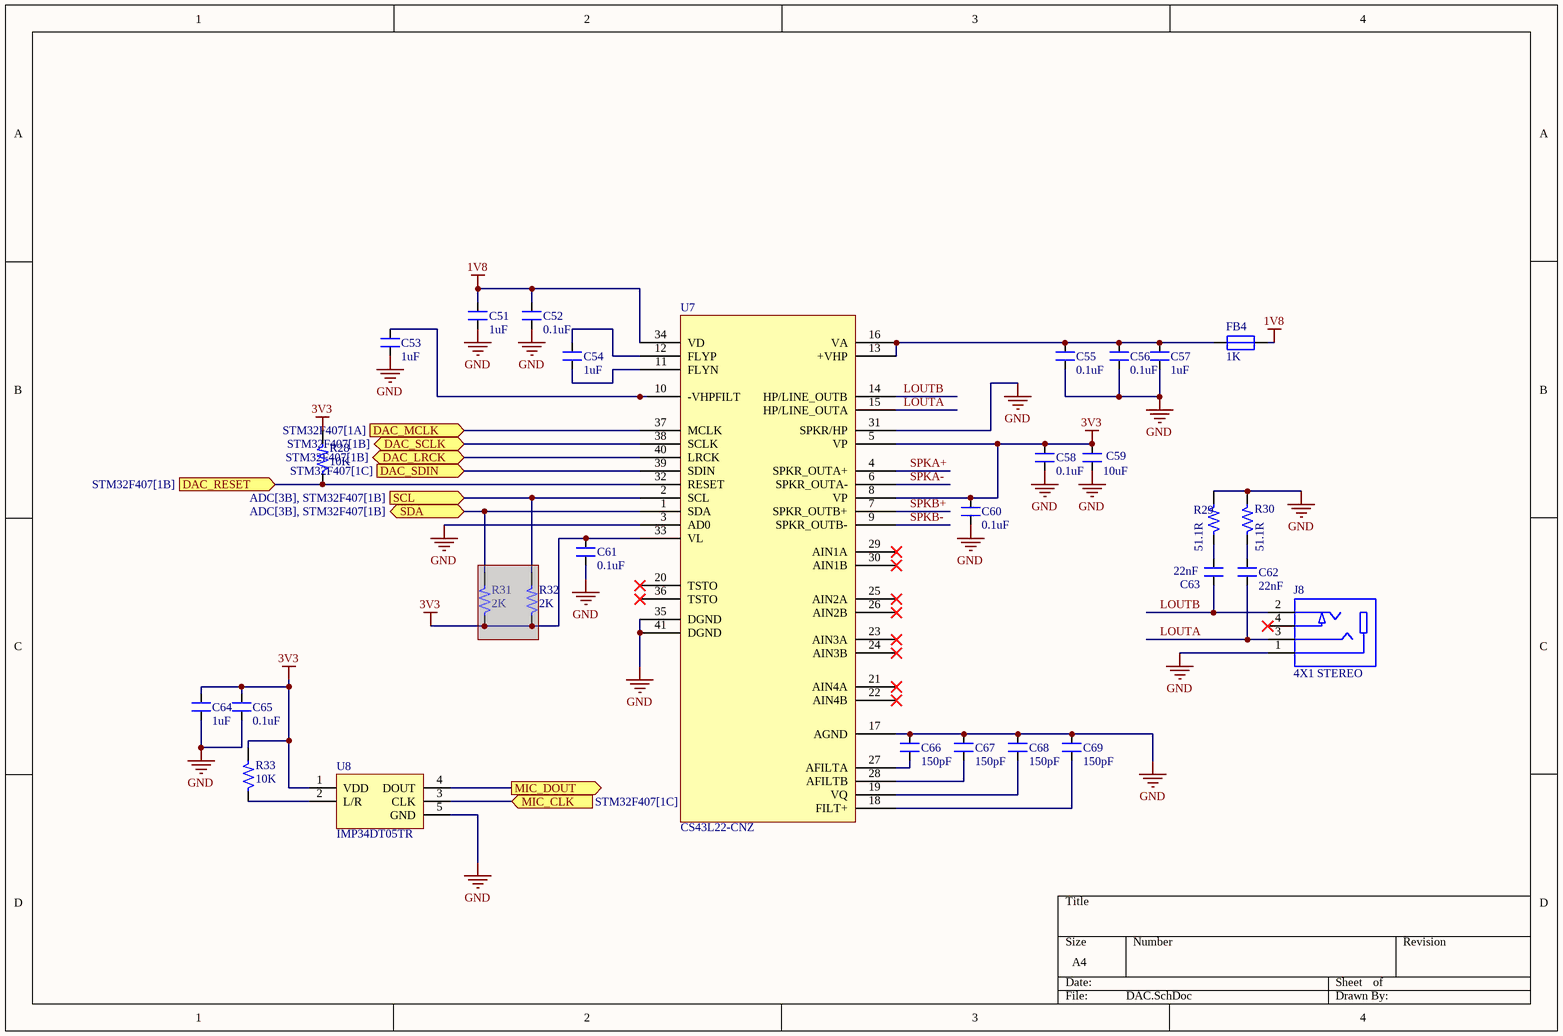
[diagram p7: DAC.SchDoc]

### Parts
C51  1uF  [CAP_0805]
C52  0.1uF  [CAP_0805]
C53  1uF  [CAP_0805]
C54  1uF  [CAP_0805]
C55  0.1uF  [CAP_0805]
C56  0.1uF  [CAP_0805]
C57  1uF  [CAP_0805]
C58  0.1uF  [CAP_0805]
C59  10uF  [CAP_1206]
C60  0.1uF  [CAP_0805]
C61  0.1uF  [CAP_0805]
C62  22nF  [CAP_0805]
C63  22nF  [CAP_0805]
C64  1uF  [CAP_0805]
C65  0.1uF  [CAP_0805]
C66  150pF  [CAP_0805]
C67  150pF  [CAP_0805]
C68  150pF  [CAP_0805]
C69  150pF  [CAP_0805]
FB4  1K  [IND_0805]
J8  4X1 STEREO  [CON_SJ-2504A-SMT-TR_SMD]
R28  10K  [RES_0603]
R29  51.1R  [RES_0603]
R30  51.1R  [RES_0603]
R31  2K  [RES_0603]  (masked out: inside a compile mask, not in the netlist)
R32  2K  [RES_0603]  (masked out: inside a compile mask, not in the netlist)
R33  10K  [RES_0603]
U7  CS43L22-CNZ  [QFN40_19_284_33X9_SMD]
U8  IMP34DT05TR  [HCLGA-4_53_137_15X37_SMD]

### Ports
DAC_LRCK (bidir, see STM32F407[1B]), DAC_MCLK (in, see STM32F407[1A]), DAC_RESET (in, see STM32F407[1B]), DAC_SCLK (bidir, see STM32F407[1B]), DAC_SDIN (in, see STM32F407[1C]), MIC_CLK (in, see STM32F407[1C]), MIC_DOUT (out), SCL (in, see ADC[3B], STM32F407[1B]), SDA (bidir, see ADC[3B], STM32F407[1B])

### Nets
1V8: C51.2 C52.2 FB4.2 U7.34(VD)
3V3: C58.2 C59.2 C60.2 C61.2 C64.2 C65.2 R28.2 R33.2 U7.5(VP) U7.8(VP) U7.33(VL) U8.1(VDD)
GND: C51.1 C52.1 C53.1 C55.1 C56.1 C57.1 C58.1 C59.1 C60.1 C61.1 C64.1 C65.1 C66.2 C67.2 C68.2 C69.2 J8.1 R29.2 R30.2 U7.3(AD0) U7.17(AGND) U7.31(SPKR/HP) U7.35(DGND) U7.41(DGND) U8.5(GND)
DAC_LRCK: U7.40(LRCK) ; port DAC_LRCK
DAC_MCLK: U7.37(MCLK) ; port DAC_MCLK
DAC_RESET: R28.1 U7.32(RESET) ; port DAC_RESET
DAC_SCLK: U7.38(SCLK) ; port DAC_SCLK
DAC_SDIN: U7.39(SDIN) ; port DAC_SDIN
LOUTA: C62.1 J8.3 U7.15(HP/LINE_OUTA)
LOUTB: C63.1 J8.2 U7.14(HP/LINE_OUTB)
MIC_CLK: U8.3(CLK) ; port MIC_CLK
MIC_DOUT: U8.4(DOUT) ; port MIC_DOUT
SCL: U7.2(SCL) ; port SCL
SDA: U7.1(SDA) ; port SDA
SPKA+: U7.4(SPKR_OUTA+)
SPKA-: U7.6(SPKR_OUTA-)
SPKB+: U7.7(SPKR_OUTB+)
SPKB-: U7.9(SPKR_OUTB-)
NetC53_2: C53.2 U7.10(-VHPFILT)
NetC54_1: C54.1 U7.11(FLYN)
NetC54_2: C54.2 U7.12(FLYP)
NetC55_2: C55.2 C56.2 C57.2 FB4.1 U7.13(+VHP) U7.16(VA)
NetC62_2: C62.2 R30.1
NetC63_2: C63.2 R29.1
NetC66_1: C66.1 U7.27(AFILTA)
NetC67_1: C67.1 U7.28(AFILTB)
NetC68_1: C68.1 U7.19(VQ)
NetC69_1: C69.1 U7.18(FILT+)
NetR33_1: R33.1 U8.2(L/R)

Not connected (* = marked no-connect by the designer): J8 4*; U7 20(TSTO)* 21(AIN4A)* 22(AIN4B)* 23(AIN3A)* 24(AIN3B)* 25(AIN2A)* 26(AIN2B)* 29(AIN1A)* 30(AIN1B)* 36(TSTO)*

### Library data of the parts
C51 C53 C54 C57 C64 = CAP_1uF-50V-5%-0805: as C4 on sheet Ethernet; Case/Package: 0805; Supplier-1: SIRICOM; Supplier Part Number-1: CL21B105KBFNNNE
C52 C55 C56 C58 C60 C61 C65 = CAP_0.1uF-50V-10%-0805: as C45 on sheet ADC; Case/Package: 0805; Supplier-1: SIRICOM; Supplier Part Number-1: 0805B104K500CT
C59 = CAP_10uF-50V-10%-1206: as C3 on sheet Ethernet; Case/Package: 1206; Supplier-1: SIRICOM; Supplier Part Number-1: CC1206KKX5R9BB106
C62 C63 = CAP_22nF-50V-10%-0805: 0.022µF ±10% 50V Ceramic Capacitor X7R 0805 (2012 Metric); Manufacturer: Samsung Electro-Mechanics; Manufacturer Part Number: CL21B223KBANNNC; Alternate Part Number-1: NA; Case/Package: 0805; Supplier-1: Digikey; Supplier Part Number-1: 1276-1081-1-ND - Cut Tape (CT)
C66-C69 = CAP_150pF-50V-10%-0805: 150pF ±10% 50V Ceramic Capacitor C0G, NP0 0805 (2012 Metric); Manufacturer: AVX Corporation; Manufacturer Part Number: 08055A151KAT2A; Alternate Part Number-1: NA; Case/Package: 0805; Supplier-1: Digikey; Supplier Part Number-1: 478-10501-1-ND - Cut Tape (CT)
FB4 = FB_1K-100MHZ-1.6A-0805: as FB1 on sheet Ethernet; Case/Package: 0805; Supplier-1: SIRICOM; Supplier Part Number-1: ACMS201209A102
J8 = CON-PLG-STEREO_4X1-100-RA-SMD: 2.50mm (0.094", 3/32", Sub Mini, Miniature) - Headphone Phone Jack Stereo (4 Conductor, TRRS) Connector Solder; Manufacturer: CUI Devices; Manufacturer Part Number: SJ-2504A-SMT-TR; Alternate Part Number-1: NA; Case/Package: SMD; Supplier Part Number-1: CP-SJ-2504A-SMT-CT-ND - Cut Tape (CT); Supplier-1: Digikey
R28 R33 = RES_10K-0.1W-1%-0603: as R2 on sheet Ethernet; Case/Package: 0603; Supplier-1: SIRICOM; Supplier Part Number-1: WR06X1002FTL
R29 R30 = RES_51.1R-0.1W-1%-0603: 51.1 Ohms ±1% 0.1W, 1/10W Chip Resistor 0603 (1608 Metric) Thick Film; Manufacturer: Vishay Dale; Manufacturer Part Number: CRCW060351R1FKEAC; Alternate Part Number-1: NA; Case/Package: 0603; Supplier-1: Digikey; Supplier Part Number-1: 541-5468-1-ND - Cut Tape (CT)
R31 R32 = RES_2K-0.125W-1%-0603: 2 kOhms ±1% 0.125W, 1/8W Chip Resistor 0603 (1608 Metric) Anti-Sulfur, Moisture Resistant Thin Film; Manufacturer: Stackpole Electronics; Manufacturer Part Number: RNCP0603FTD2K00; Alternate Part Number-1: NA; Case/Package: 0603; Supplier-1: SIRICOM; Supplier Part Number-1: WR06X2001FTL
U7 = IC_CS43L22: Audio D/A Converter ICs Low Power Stereo DAC w/ClassD Spkr Driver; Manufacturer: Cirrus Logic; Alternate Part Number-1: NA; Manufacturer Part Number: CS43L22-CNZ; Case/Package: QFN-40; Supplier-1: Mouser; Supplier Part Number-1: 777-CS43L22-CNZ
U8 = IC_IMP34DT05TR: MEMS Microphones AUTO & INDUSTRIAL SENSORS; Manufacturer: STMicroelectronics; Alternate Part Number-1: NA; Manufacturer Part Number: IMP34DT05TR; Case/Package: HCLGA-4; Supplier-1: Mouser; Supplier Part Number-1: 511-IMP34DT05TR

## Sheet Mic.SchDoc
size A4; SheetNumber: 9; SheetTotal: 9

## Sheet MotorDriver2.SchDoc
size A4; SheetNumber: 10; SheetTotal: 11
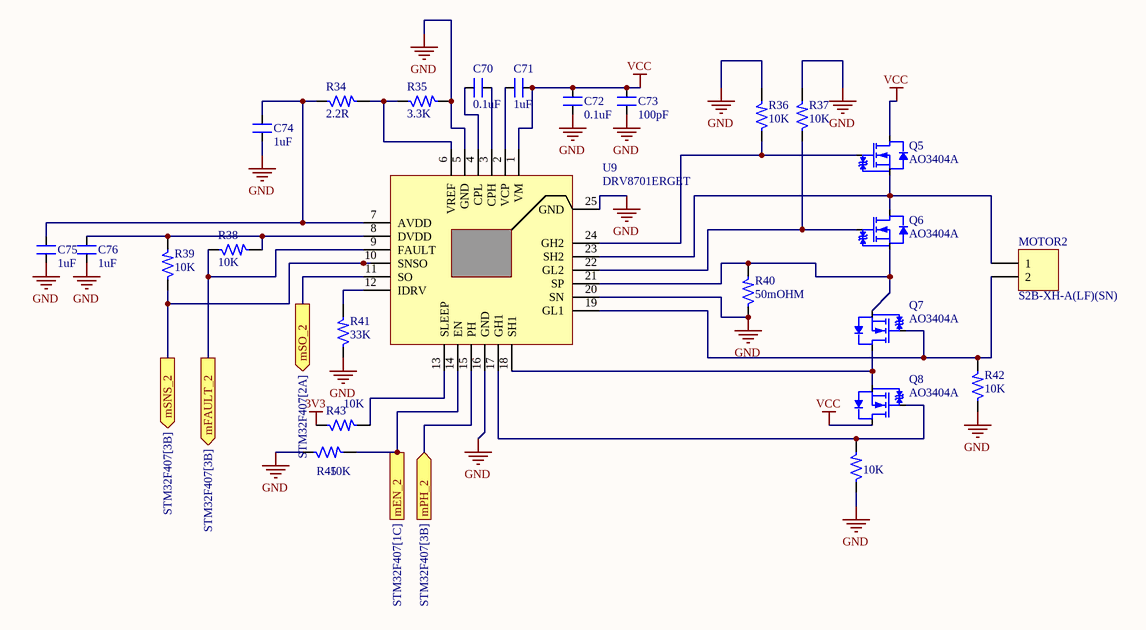
[diagram p8: MotorDriver2.SchDoc]

### Parts
C70  0.1uF  [CAP_0805]
C71  1uF  [CAP_0805]
C72  0.1uF  [CAP_0805]
C73  100pF  [CAP_0805]
C74  1uF  [CAP_0805]
C75  1uF  [CAP_0805]
C76  1uF  [CAP_0805]
MOTOR2  S2B-XH-A(LF)(SN)  [CON2_100_S2B-XH-A_TH_RA]
Q5  AO3404A  [SOT 23-3]
Q6  AO3404A  [SOT 23-3]
Q7  AO3404A  [SOT 23-3]
Q8  AO3404A  [SOT 23-3]
R34  2.2R  [RES_0603]
R35  3.3K  [RES_0805]
R36  10K  [RES_0805]
R37  10K  [RES_0805]
R38  10K  [RES_0805]
R39  10K  [RES_0805]
R40  50mOHM  [RES_2512]
R41  33K  [RES_0805]
R42  10K  [RES_0805]
R43  10K  [RES_0805]
R44  10K  [RES_0805]
R45  10K  [RES_0805]
U9  DRV8701ERGET  [VFQFN24_19.6_196_12X32_SMD_1]

### Ports
mEN_2 (in, see STM32F407[1C]), mFAULT_2 (out, see STM32F407[3B]), mPH_2 (in, see STM32F407[3B]), mSNS_2 (out, see STM32F407[3B]), mSO_2 (out, see STM32F407[2A])

### Nets
3V3: R43.1
GND: C72.1 C73.1 C74.1 C75.1 C76.1 R35.2 R36.2 R37.2 R40.1 R41.1 R42.1 R44.1 R45.1 U9.5(GND) U9.16(GND) U9.20(SN) U9.25(GND)
VCC: C71.1 C72.2 C73.2 Q5.3(D) Q8.3(D) U9.1(VM)
mEN_2: R45.2 U9.14(EN) ; port mEN_2
mFAULT_2: R38.1 U9.9(FAULT) ; port mFAULT_2
mPH_2: U9.15(PH) ; port mPH_2
mSNS_2: R39.1 U9.10(SNSO) ; port mSNS_2
mSO_2: U9.11(SO) ; port mSO_2
NetC70_1: C70.1 U9.3(CPH)
NetC70_2: C70.2 U9.4(CPL)
NetC71_2: C71.2 U9.2(VCP)
NetC74_2: C74.2 C75.2 R34.1 U9.7(AVDD)
NetC76_2: C76.2 R38.2 R39.2 U9.8(DVDD)
NetMOTOR2_1: MOTOR2.1 Q5.2(S) Q6.3(D) U9.23(SH2)
NetMOTOR2_2: MOTOR2.2 Q7.1(G) R42.2 U9.19(GL1)
NetQ5_1: Q5.1(G) R36.1 U9.24(GH2)
NetQ6_1: Q6.1(G) R37.1 U9.22(GL2)
NetQ6_2: Q6.2(S) Q7.2(S) R40.2 U9.21(SP)
NetQ7_3: Q7.3(D) Q8.2(S) U9.18(SH1)
NetQ8_1: Q8.1(G) R44.2 U9.17(GH1)
NetR34_2: R34.2 R35.1 U9.6(VREF)
NetR41_2: R41.2 U9.12(IDRV)
NetR43_2: R43.2 U9.13(SLEEP)

### Library data of the parts
C70 C72 = CAP_0.1uF-50V-20%-0805: as C13 on sheet STM32F103_DEBUG; Case/Package: 0805; Supplier-1: SIRICOM; Supplier Part Number-1: 0805B104K500CT
C71 C74-C76 = CAP_1uF-50V-5%-0805: as C4 on sheet Ethernet; Case/Package: 0805; Supplier-1: SIRICOM; Supplier Part Number-1: CL21B105KBFNNNE
C73 = CAP_100pF-100V-5%-0805: as C40 on sheet MotorDriver; Case/Package: 0805; Supplier-1: SIRICOM; Supplier Part Number-1: 0805N101J101CT
MOTOR2 = CON-PLG_2X1-100-RA-TH: as MOTOR1 on sheet MotorDriver; Manufacturer Part Number: S2B-XH-A(LF)(SN); Case/Package: TH-CON; Supplier-1: ARROW; Supplier Part Number-1: S2B-XH-A(LF)(SN)
Q5-Q8 = MOSFET-N_30V-5.8A-SOT23: as Q1 on sheet MotorDriver; Manufacturer Part Number: AO3404A; Case/Package: SOT23; Supplier-1: ARROW; Supplier Part Number-1: AO3404A
R34 = RES_2.2R-0.1W-1%-0603: as R14 on sheet MotorDriver; Case/Package: 0603; Supplier-1: SIRICOM; Supplier Part Number-1: NA
R35 = RES_3.3K-0.125W-1%-0805: as R15 on sheet MotorDriver; Case/Package: 0805; Supplier-1: SIRICOM; Supplier Part Number-1: WR08X3301FTL
R36-R39 R42-R45 = RES_10K-0.125W-1%-0805: as R1 on sheet Ethernet; Case/Package: 0805; Supplier-1: SIRICOM; Supplier Part Number-1: WR08X1002FTL; Alternate Part Number-1: WR08X1002FTL
R40 = RES_50mOhm-2W-1%-2512: as R20 on sheet MotorDriver; Case/Package: 2512; Supplier-1: SIRICOM; Supplier Part Number-1: LR2512-22R060F1
R41 = RES_33K-0.125W-1%-0805: as R21 on sheet MotorDriver; Case/Package: 0805; Supplier-1: SIRICOM; Supplier Part Number-1: WR08X3302FTL
U9 = IC_DRV8701ERGET: as U4 on sheet MotorDriver; Manufacturer Part Number: DRV8701ERGET; Case/Package: VFQFN24; Supplier-1: ARROW; Supplier Part Number-1: DRV8701ERGET

## Sheet PowerSupply.SchDoc
size A4; SheetNumber: 11; SheetTotal: 11
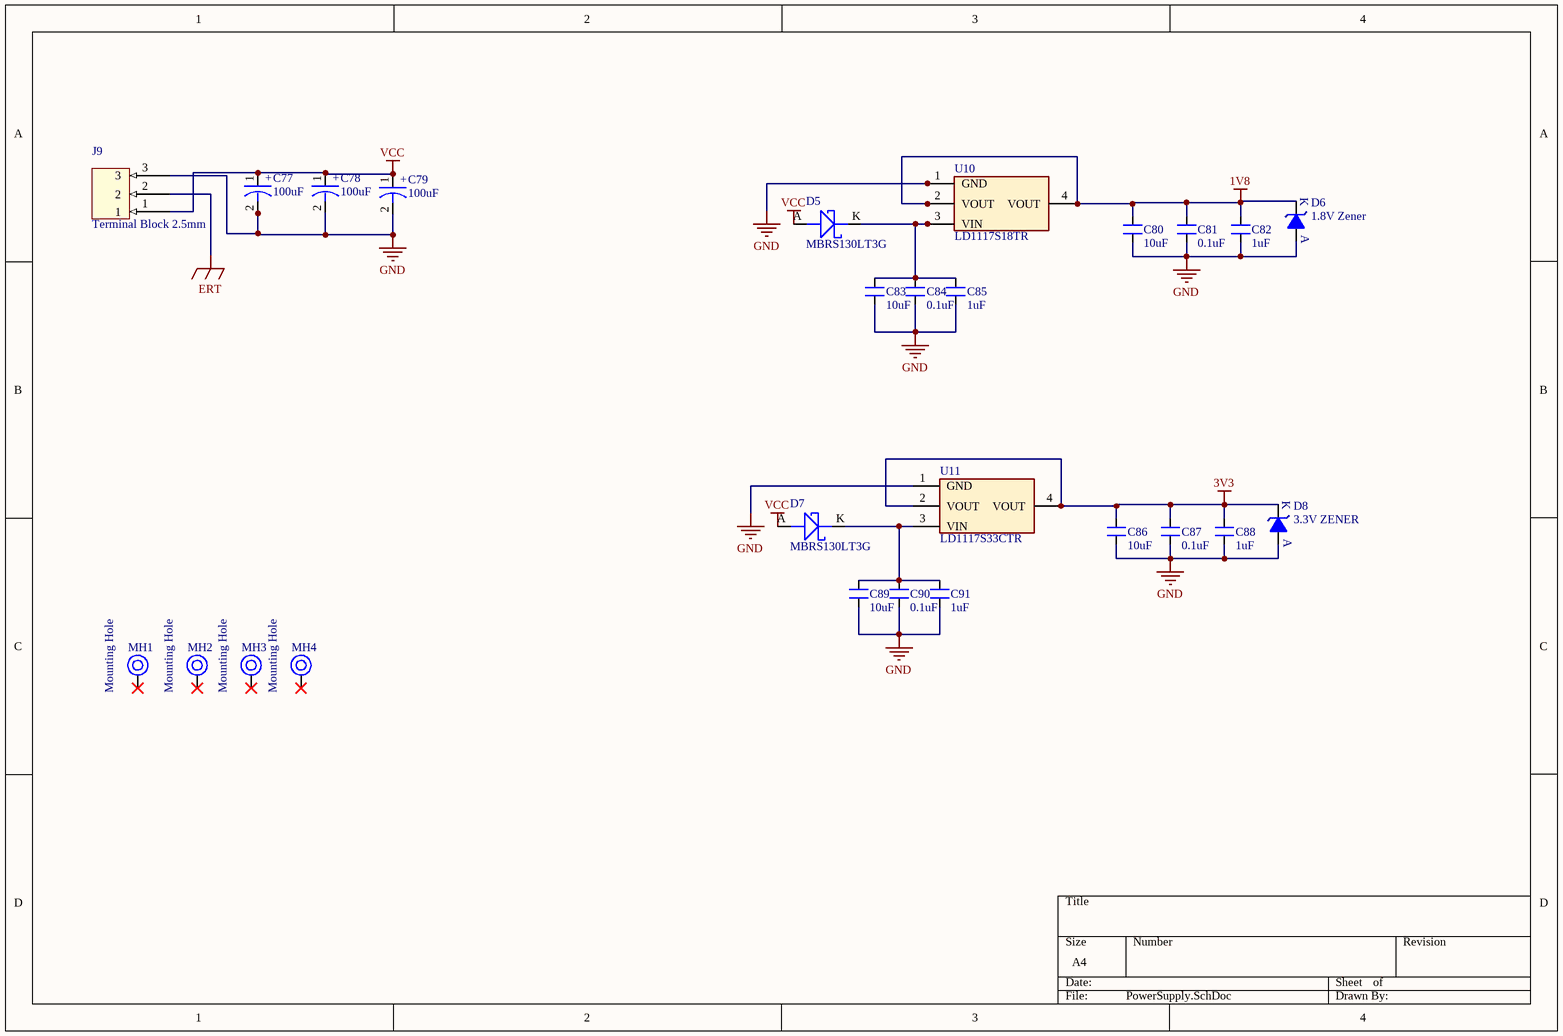
[diagram p9: PowerSupply.SchDoc]

### Parts
C77  100uF  [ACAP_P236_D305_H303_RAD]
C78  100uF  [ACAP_P236_D305_H303_RAD]
C79  100uF  [ACAP_P236_D305_H303_RAD]
C80  10uF  [CAP_1206]
C81  0.1uF  [CAP_0805]
C82  1uF  [CAP_0805]
C83  10uF  [CAP_1206]
C84  0.1uF  [CAP_0805]
C85  1uF  [CAP_0805]
C86  10uF  [CAP_1206]
C87  0.1uF  [CAP_0805]
C88  1uF  [CAP_0805]
C89  10uF  [CAP_1206]
C90  0.1uF  [CAP_0805]
C91  1uF  [CAP_0805]
D5  MBRS130LT3G  [DIO_SMB_DO-214AA]
D6  1.8V Zener  [DIO_DO-213AB_SMD]
D7  MBRS130LT3G  [DIO_SMB_DO-214AA]
D8  3.3V ZENER  [DIO_SOD80C]
J9  Terminal Block 2.5mm  [CON3_100_TB_TH_ST]
MH1  Mounting Hole  [MOUNTING]
MH2  Mounting Hole  [MOUNTING]
MH3  Mounting Hole  [MOUNTING]
MH4  Mounting Hole  [MOUNTING]
U10  LD1117S18TR  [SOT223_3]
U11  LD1117S33CTR  [SOT223_3]

### Nets
1V8: C80.2 C81.2 C82.2 D6.K U10.2(VOUT) U10.4(VOUT)
3V3: C86.2 C87.2 C88.2 D8.K U11.2(VOUT) U11.4(VOUT)
ERT: J9.2
GND: C77.2 C78.2 C79.2 C80.1 C81.1 C82.1 C83.1 C84.1 C85.1 C86.1 C87.1 C88.1 C89.1 C90.1 C91.1 D6.A D8.A J9.3 U10.1(GND) U11.1(GND)
VCC: C77.1 C78.1 C79.1 D5.A D7.A J9.1
NetC83_2: C83.2 C84.2 C85.2 D5.K U10.3(VIN)
NetC89_2: C89.2 C90.2 C91.2 D7.K U11.3(VIN)

Not connected (* = marked no-connect by the designer): MH1 1*; MH2 1*; MH3 1*; MH4 1*

### Notes on the sheet
- (in symbol CAP-P_100uF-25V-20%-RAD) +

### Library data of the parts
C77-C79 = CAP-P_100uF-25V-20%-RAD: 100µF 25V Aluminum Electrolytic Capacitors Radial, Can - SMD 1000 Hrs @ 105°C; Manufacturer: Nichicon; Manufacturer Part Number: UWT1E101MCL1GS; Alternate Part Number-1: NA; Case/Package: Radial-SMD; Supplier-1: SP ROAD; Supplier Part Number-1: UWT1E101MCL1GS
C80 C83 C86 C89 = CAP_10uF-50V-10%-1206: as C3 on sheet Ethernet; Case/Package: 1206; Supplier-1: SIRICOM; Supplier Part Number-1: CC1206KKX5R9BB106
C81 C84 C87 C90 = CAP_0.1uF-50V-10%-0805: as C45 on sheet ADC; Case/Package: 0805; Supplier-1: SIRICOM; Supplier Part Number-1: 0805B104K500CT
C82 C85 C88 C91 = CAP_1uF-50V-5%-0805: as C4 on sheet Ethernet; Case/Package: 0805; Supplier-1: SIRICOM; Supplier Part Number-1: CL21B105KBFNNNE
D5 D7 = DIO-S_445mV-30V-2A-SMB: Diode Schottky 30V 2A Surface Mount SMB; Manufacturer: ON Semiconductor; Alternate Part Number-1: NA; Manufacturer Part Number: MBRS130LT3G; Case/Package: SMB; Supplier-1: ARROW; Supplier Part Number-1: MBRS130LT3G
D6 = DIO-Z_1.8V-500mW-DO213AA: Zener Diode 1.8V 500mW ±5% Surface Mount DO-213AA; Manufacturer: *; Manufacturer Part Number: *; Case/Package: *; Supplier-1: *; Supplier Part Number-1: *; Alternate Part Number-1: *
D8 = DIO-Z_3.3V-500mW-SOD-80: Zener Diode 3.3V 500mW ±5% Surface Mount LLDS; MiniMelf; Manufacturer: Vishay Semiconductors; Manufacturer Part Number: BZV55-C3V3,135; Alternate Part Number-1: TZM5226B-GS08; Case/Package: SOD-80; Supplier-1: SIRICOM; Supplier Part Number-1: BZV55-C3V3
J9 = CON-TB_3X1-100-ST-TH: 3 Pins, 1 Row 2.54mm Pitch, straight Connector, male; Manufacturer Part Number: 1725669; Manufacturer: Phoenix Contact; Alternate Part Number-1: NA; Case/Package: TH-CON; Supplier-1: SP ROAD; Supplier Part Number-1: 1725669
MH1-MH4 = MH_3.5H_6D: Manufacturer Part Number: NA; Case/Package: TH; Manufacturer: NA; Supplier-1: NA; Supplier Part Number-1: NA; Alternate Part Number-1: NA
U10 = REG_15V-1.8V-0.8A-1.4W-SOT223: LDO Voltage Regulators 1.8V 0.8A Positive; Manufacturer: STMicroelectronics; Alternate Part Number-1: NA; Manufacturer Part Number: LD1117S18TR; Case/Package: SOT-223-3; Supplier-1: Mouser; Supplier Part Number-1: 511-LD1117S18-TR
U11 = REG_15V-3.3V-0.9A-12W-SOT223: Linear Voltage Regulator IC 1 Output 800mA SOT-223; Manufacturer: STMicroelectronics; Alternate Part Number-1: NA; Manufacturer Part Number: LD1117S33CTR; Case/Package: SOT223; Supplier-1: SP ROAD; Supplier Part Number-1: LD1117S33CTR

## Nets that join several sheets
1V8: DAC (C51.2 C52.2 FB4.2 U7.34), PowerSupply (6 pins)
3.3V: STM32F103_DEBUG (13 pins), MotorDriver (R23.1)
3V3: STM32F407 (19 pins), UART (C44.2 U5.4 U5.16), ADC (8 pins), DAC (12 pins), MotorDriver2 (R43.1), PowerSupply (6 pins)
ERT: Ethernet (C12.1 R6.1), PowerSupply (J9.2)
GND: Ethernet (20 pins), STM32F103_DEBUG (18 pins), STM32F407 (26 pins), MotorDriver (17 pins), UART (7 pins), ADC (10 pins), DAC (25 pins), MotorDriver2 (17 pins), PowerSupply (20 pins)
VCC: MotorDriver (6 pins), MotorDriver2 (6 pins), PowerSupply (6 pins)
ADC_DRDY: STM32F407 (U3.56), ADC (U6.14)
ADC_RESET: STM32F407 (U3.55), ADC (SW4.1 U6.3)
COL1: Ethernet (DS1.A U1.28), STM32F407 (U3.26)
COL2: Ethernet (DS2.A U1.29), STM32F407 (U3.23)
DAC_LRCK: STM32F407 (U3.90), DAC (U7.40)
DAC_MCLK: STM32F407 (U3.29), DAC (U7.37)
DAC_RESET: STM32F407 (U3.54), DAC (R28.1 U7.32)
DAC_SCLK: STM32F407 (U3.89), DAC (U7.38)
DAC_SDIN: STM32F407 (U3.80), DAC (U7.39)
ETH_RST: Ethernet (R1.1 SW1.2 U1.32), STM32F407 (U3.64)
JTCLK_F407: STM32F103_DEBUG (U2.18), STM32F407 (U3.76)
JTMS_F407: STM32F103_DEBUG (U2.25 U2.27), STM32F407 (U3.72)
MDC: Ethernet (U1.12), STM32F407 (U3.16)
MDIO: Ethernet (R4.2 U1.11), STM32F407 (U3.25)
mEN: STM32F407 (U3.45), MotorDriver (R25.2 U4.14)
mEN_2: STM32F407 (U3.66), MotorDriver2 (R45.2 U9.14)
mFAULT: STM32F407 (U3.62), MotorDriver (R18.1 U4.9)
mFAULT_2: STM32F407 (U3.59), MotorDriver2 (R38.1 U9.9)
MIC_CLK: STM32F407 (U3.65), DAC (U8.3)
mPH: STM32F407 (U3.63), MotorDriver (U4.15)
mPH_2: STM32F407 (U3.60), MotorDriver2 (U9.15)
mSNS: STM32F407 (U3.61), MotorDriver (R19.1 U4.10)
mSNS_2: STM32F407 (U3.58), MotorDriver2 (R39.1 U9.10)
mSO: STM32F407 (U3.30), MotorDriver (U4.11)
mSO_2: STM32F407 (U3.31), MotorDriver2 (U9.11)
NRST_F407: STM32F103_DEBUG (U2.26), STM32F407 (R12.1 SW3.2 U3.14)
RX_CLK: Ethernet (U1.19), STM32F407 (U3.24)
RX_D0: Ethernet (U1.16), STM32F407 (U3.33)
RX_D1: Ethernet (U1.15), STM32F407 (U3.34)
RX_D2: Ethernet (U1.14), STM32F407 (U3.35)
RX_D3: Ethernet (U1.13), STM32F407 (U3.36)
RX_DV: Ethernet (U1.18), STM32F407 (U3.32)
RX_ER: Ethernet (U1.20), STM32F407 (U3.47)
SCL: STM32F407 (U3.92), ADC (R26.1 U6.16), DAC (U7.2)
SDA: STM32F407 (U3.93), ADC (R27.1 U6.15), DAC (U7.1)
TX_CLK: Ethernet (U1.22), STM32F407 (U3.18)
TX_D1: Ethernet (U1.25), STM32F407 (U3.52)
TX_D2: Ethernet (U1.26), STM32F407 (U3.17)
TX_D3: Ethernet (U1.27), STM32F407 (U3.1)
TX_DO: Ethernet (U1.24), STM32F407 (U3.51)
TX_EN: Ethernet (U1.23), STM32F407 (U3.48)
uRST: STM32F407 (U3.57), UART (U5.14)
uRX: STM32F407 (U3.79), UART (U5.3)
uTX: STM32F407 (U3.78), UART (U5.2)